# Altium schematic sheet Recepitor.SchDoc
size A4
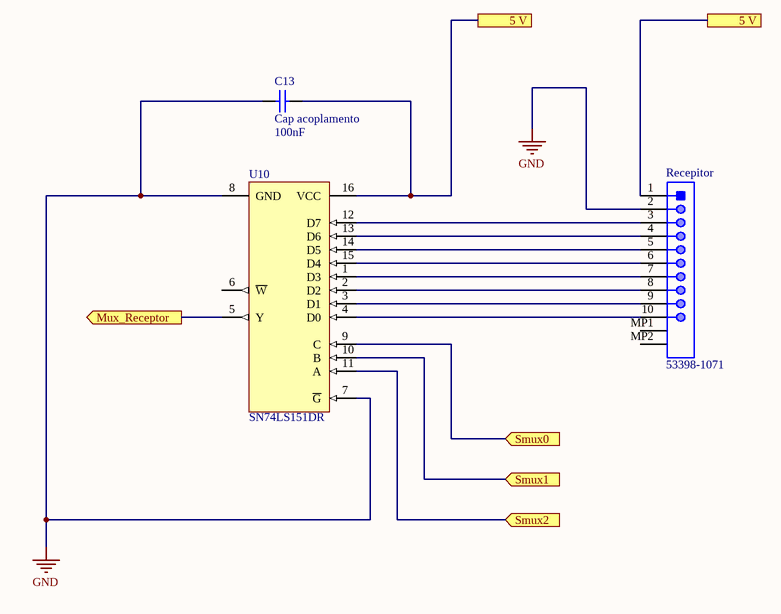
[diagram p0: Recepitor.SchDoc]

## Parts
C13  Cap acoplamento  value 100nF  [C1206]
Recepitor  53398-1071  [MOLX-53398-1071_V]
U10  SN74LS151DR  [D0016A_L]

## Ports
5 V, Mux_Receptor (out), Smux0 (in), Smux1 (in), Smux2 (in)

## Nets
GND: C13.1 Recepitor.2 U10.7(~{G}) U10.8(GND)
5 V: C13.2 Recepitor.1 U10.16(VCC) ; port 5 V
Mux_Receptor: U10.5(Y) ; port Mux_Receptor
Smux0: U10.9(C) ; port Smux0
Smux1: U10.10(B) ; port Smux1
Smux2: U10.11(A) ; port Smux2
NetRecepitor_3: Recepitor.3 U10.12(D7)
NetRecepitor_4: Recepitor.4 U10.13(D6)
NetRecepitor_5: Recepitor.5 U10.14(D5)
NetRecepitor_6: Recepitor.6 U10.15(D4)
NetRecepitor_7: Recepitor.7 U10.1(D3)
NetRecepitor_8: Recepitor.8 U10.2(D2)
NetRecepitor_9: Recepitor.9 U10.3(D1)
NetRecepitor_10: Recepitor.10 U10.4(D0)

Not connected (* = marked no-connect by the designer): Recepitor MP1 MP2; U10 6(~{W})

## Library data of the parts
C13 = Cap Semi: Capacitor (Semiconductor SIM Model); Published: 8-Jun-2000; LatestRevisionDate: 29-May-2009; LatestRevisionNote: IPC-7351 Footprint Added.; PackageReference: C1206; Publisher: Altium Limited; PackageDescription: Chip Capacitor
Recepitor = CMP-2000-05635-1: Male Header, Pitch 1.25 mm, 1 x 10 Position, Height 4.7 mm, -40 to 85 degC, RoHS, Tape and Reel; Manufacturer: Molex; Mounting Angle: Vertical; Pitch: 1.25mm; Voltage Rating: 125V; Current Rating: 1A; Number of Rows: 1Row; Housing Material: Nylon; Mounting Technology: SurfaceMount; Mounting Style: SMD; Contact Material: PhosphorBronze; Product: Headers; Datasheet URL: http://www.molex.com/pdm_docs/sd/533981071_sd.pdf; Manufacturer URL: http://www.molex.com/; Datasheet Version: Rev. J, 09/2015; Factory Pack Quantity: 1000; Brand: Molex; Packaging: Reel; Product Category: Headers&WireHousings; Contact Gender: Pin(Male); Number of Positions: 10Position; RoHS: Details; Contact Plating: Tin; Package Description: Male Header, Pitch 1.25 mm, 1 x 10 Position, Height 4.7 mm; Series: 53398; Type: Shrouded; Package Reference: 53398-1071; Tradename: PicoBlade; Termination Style: SMD
U10 = CMP-1633-00148-1: 8-Line To 1-Line Data Selectors/Multiplexers, D0016A, LARGE T&R; Manufacturer: Texas Instruments; VCC(Max)(V): 5.25; Configuration: "16","1"; Channels(#): 1; F @ Nom Voltage(Max)(Mhz): 35; Input Type: TTL; Output Drive (IOL/IOH)(Max)(mA): 8/-0.4; Voltage(Nom)(V): 5; Bits(#): 16; VCC(Min)(V): 4.75; Technology Family: LS; tpd @ Nom Voltage(Max)(ns): 38; Function: Encoder/Multiplexer; Schmitt Trigger: No; Rating: Catalog; ICC @ Nom Voltage(Max)(mA): 10; PartNumber: SN74LS151DR; Operating Temperature Range(C): 0 to 70; Type: Standard; ComponentLink3URL: http://www.ti.com/lit/ml/mpds178g/mpds178g.pdf; ComponentLink1Description: Manufacturer URL; ComponentLink2Description: Datasheet; DatasheetVersion: SDLS054; Output Type: TTL; PackageReference: D0016A; ComponentLink1URL: http://www.ti.com/; Code_JEDEC: MS-012 variation AC; ComponentLink2URL: http://www.ti.com/lit/ds/symlink/sn74ls151.pdf; ComponentLink3Description: Package Specification; Generic Part Number: SN74LS151